# EAGLE schematic S151B (EAGLE 4.11)
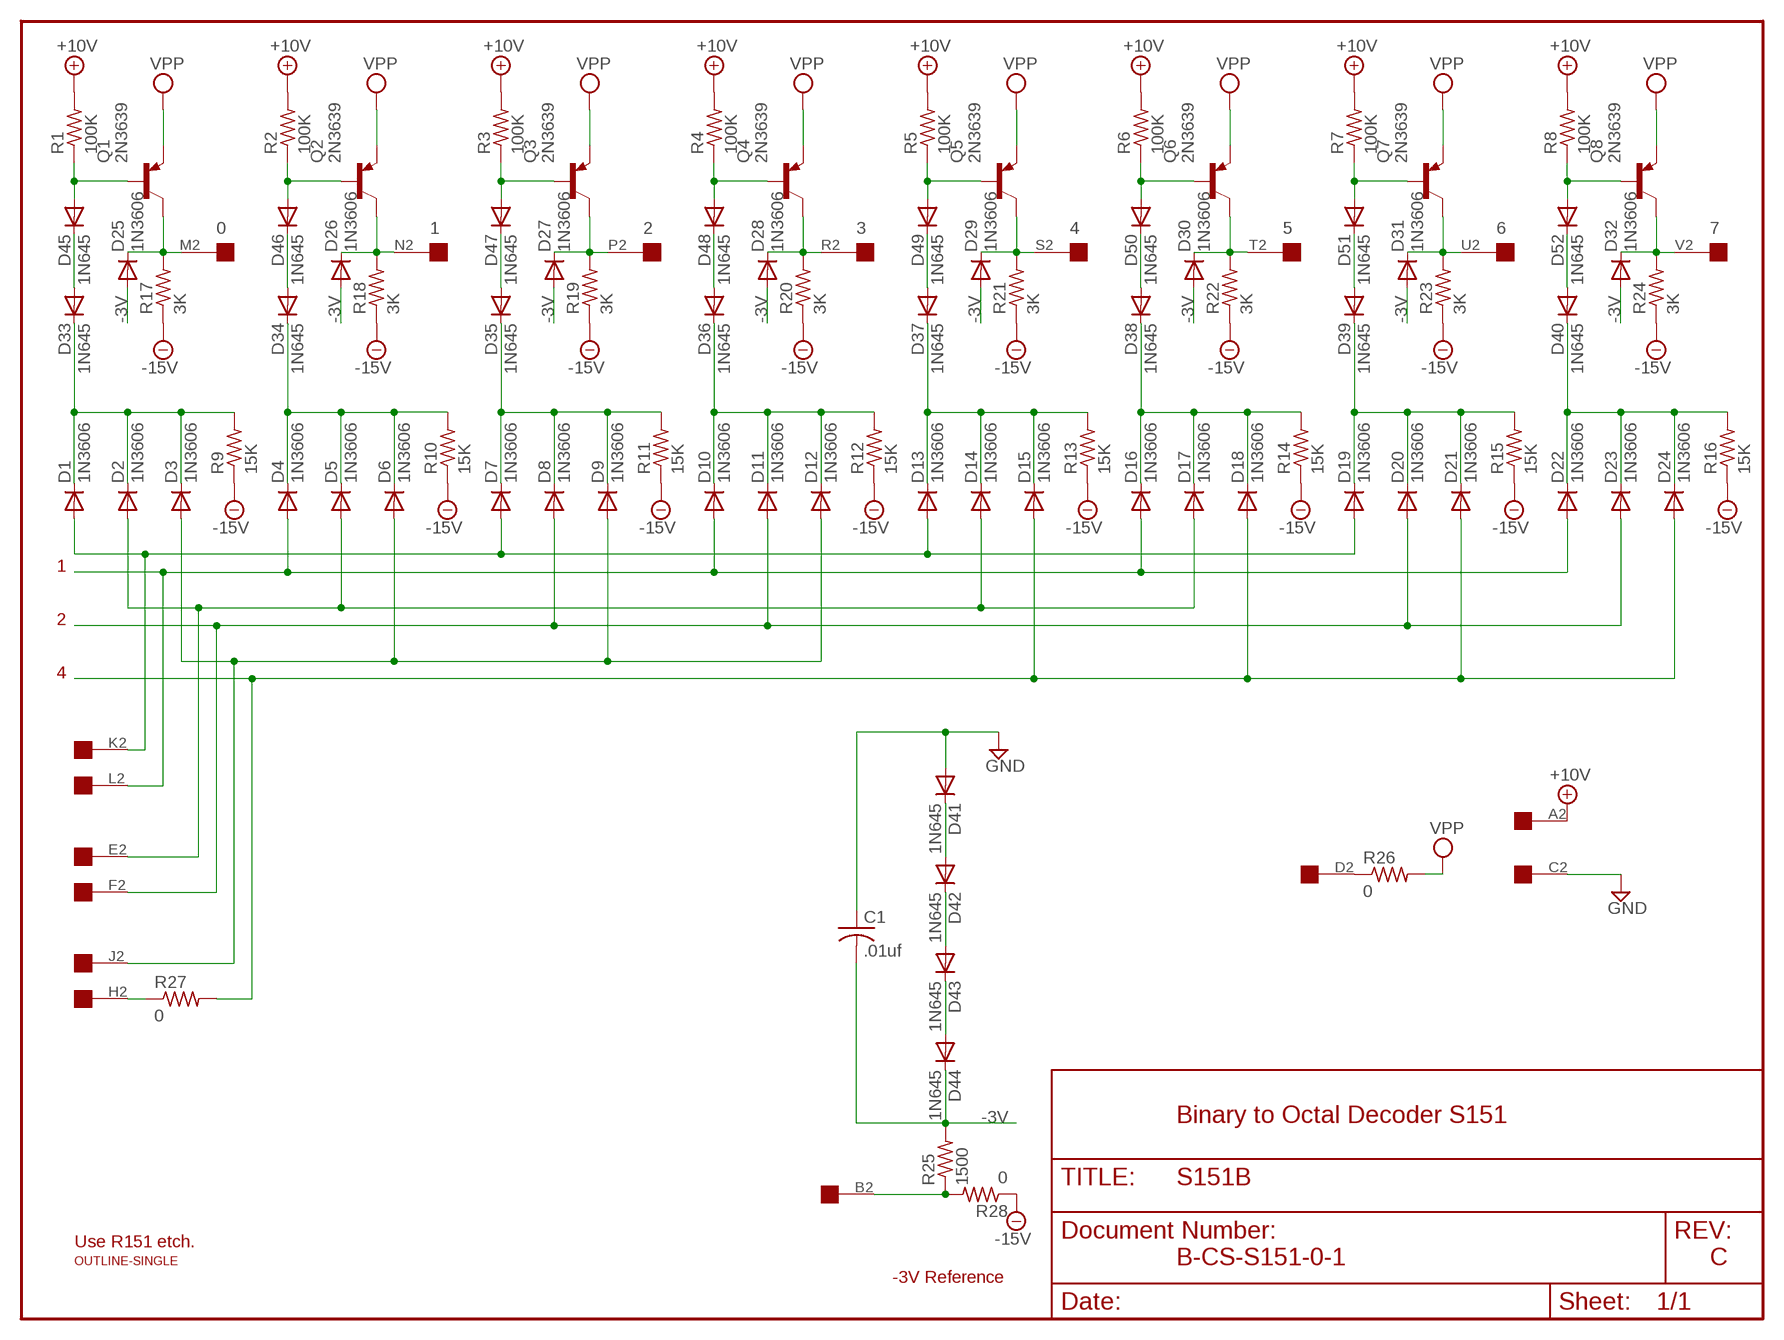
[diagram p0: schematic, sheet 1]

## Parts
C1  .01uf  C-US050-025X075  [C050-025X075]
D1  1N3606  1N4148  [DO35-10]
D2  1N3606  1N4148  [DO35-10]
D3  1N3606  1N4148  [DO35-10]
D4  1N3606  1N4148  [DO35-10]
D5  1N3606  1N4148  [DO35-10]
D6  1N3606  1N4148  [DO35-10]
D7  1N3606  1N4148  [DO35-10]
D8  1N3606  1N4148  [DO35-10]
D9  1N3606  1N4148  [DO35-10]
D10  1N3606  1N4148  [DO35-10]
D11  1N3606  1N4148  [DO35-10]
D12  1N3606  1N4148  [DO35-10]
D13  1N3606  1N4148  [DO35-10]
D14  1N3606  1N4148  [DO35-10]
D15  1N3606  1N4148  [DO35-10]
D16  1N3606  1N4148  [DO35-10]
D17  1N3606  1N4148  [DO35-10]
D18  1N3606  1N4148  [DO35-10]
D19  1N3606  1N4148  [DO35-10]
D20  1N3606  1N4148  [DO35-10]
D21  1N3606  1N4148  [DO35-10]
D22  1N3606  1N4148  [DO35-10]
D23  1N3606  1N4148  [DO35-10]
D24  1N3606  1N4148  [DO35-10]
D25  1N3606  1N4148  [DO35-10]
D26  1N3606  1N4148  [DO35-10]
D27  1N3606  1N4148  [DO35-10]
D28  1N3606  1N4148  [DO35-10]
D29  1N3606  1N4148  [DO35-10]
D30  1N3606  1N4148  [DO35-10]
D31  1N3606  1N4148  [DO35-10]
D32  1N3606  1N4148  [DO35-10]
D33  1N645  1N4148  [DO35-10]
D34  1N645  1N4148  [DO35-10]
D35  1N645  1N4148  [DO35-10]
D36  1N645  1N4148  [DO35-10]
D37  1N645  1N4148  [DO35-10]
D38  1N645  1N4148  [DO35-10]
D39  1N645  1N4148  [DO35-10]
D40  1N645  1N4148  [DO35-10]
D41  1N645  1N4148  [DO35-10]
D42  1N645  1N4148  [DO35-10]
D43  1N645  1N4148  [DO35-10]
D44  1N645  1N4148  [DO35-10]
D45  1N645  1N4148  [DO35-10]
D46  1N645  1N4148  [DO35-10]
D47  1N645  1N4148  [DO35-10]
D48  1N645  1N4148  [DO35-10]
D49  1N645  1N4148  [DO35-10]
D50  1N645  1N4148  [DO35-10]
D51  1N645  1N4148  [DO35-10]
D52  1N645  1N4148  [DO35-10]
Q1  2N3639  2N3637  [TO39]
Q2  2N3639  2N3637  [TO39]
Q3  2N3639  2N3637  [TO39]
Q4  2N3639  2N3637  [TO39]
Q5  2N3639  2N3637  [TO39]
Q6  2N3639  2N3637  [TO39]
Q7  2N3639  2N3637  [TO39]
Q8  2N3639  2N3637  [TO39]
R1  100K  R-US_0207/10  [0207/10]
R2  100K  R-US_0207/10  [0207/10]
R3  100K  R-US_0207/10  [0207/10]
R4  100K  R-US_0207/10  [0207/10]
R5  100K  R-US_0207/10  [0207/10]
R6  100K  R-US_0207/10  [0207/10]
R7  100K  R-US_0207/10  [0207/10]
R8  100K  R-US_0207/10  [0207/10]
R9  15K  R-US_0207/10  [0207/10]
R10  15K  R-US_0207/10  [0207/10]
R11  15K  R-US_0207/10  [0207/10]
R12  15K  R-US_0207/10  [0207/10]
R13  15K  R-US_0207/10  [0207/10]
R14  15K  R-US_0207/10  [0207/10]
R15  15K  R-US_0207/10  [0207/10]
R16  15K  R-US_0207/10  [0207/10]
R17  3K  R-US_0207/10  [0207/10]
R18  3K  R-US_0207/10  [0207/10]
R19  3K  R-US_0207/10  [0207/10]
R20  3K  R-US_0207/10  [0207/10]
R21  3K  R-US_0207/10  [0207/10]
R22  3K  R-US_0207/10  [0207/10]
R23  3K  R-US_0207/10  [0207/10]
R24  3K  R-US_0207/10  [0207/10]
R25  1500  R-US_0207/10  [0207/10]
R26  0  R-US_0207/10  [0207/10]
R27  0  R-US_0207/10  [0207/10]
R28  0  R-US_0207/10  [0207/10]
U$1  OUTLINE-SINGLE  [SINGLE]
U$2  EDGE-1  [EDGE-CON1]

## Nets
0: D25.C Q1.3(C) R17.2 U$2.M2
1: D26.C Q2.3(C) R18.2 U$2.N2
2: D27.C Q3.3(C) R19.2 U$2.P2
3: D28.C Q4.3(C) R20.2 U$2.R2
4: D29.C Q5.3(C) R21.2 U$2.S2
5: D30.C Q6.3(C) R22.2 U$2.T2
6: D31.C Q7.3(C) R23.2 U$2.U2
7: D32.C Q8.3(C) R24.2 U$2.V2
+10V [Power]: R1.2 R2.2 R3.2 R4.2 R5.2 R6.2 R7.2 R8.2 U$2.A2
-3V [Power]: C1.2 D25.A D26.A D27.A D28.A D29.A D30.A D31.A D32.A D44.C R25.2
-15V [Power]: R9.1 R10.1 R11.1 R12.1 R13.1 R14.1 R15.1 R16.1 R17.1 R18.1 R19.1 R20.1 R21.1 R22.1 R23.1 R24.1 R28.1
D0: D4.A D10.A D16.A D22.A U$2.L2
D0\: D1.A D7.A D13.A D19.A U$2.K2
D1: D8.A D11.A D20.A D23.A U$2.F2
D1\: D2.A D5.A D14.A D17.A U$2.E2
D2: D15.A D18.A D21.A D24.A R27.2
D2\: D3.A D6.A D9.A D12.A U$2.J2
GND [Power]: C1.1 D41.A U$2.C2
N$1 [Power]: R25.1 R28.2 U$2.B2
N$2: D46.A Q2.2(B) R2.1
N$3: D41.C D42.A
N$4: R26.1 U$2.D2
N$5: R27.1 U$2.H2
N$6: D4.C D5.C D6.C D34.C R10.2
N$7: D34.A D46.C
N$8: D47.A Q3.2(B) R3.1
N$11: D7.C D8.C D9.C D35.C R11.2
N$12: D35.A D47.C
N$13: D42.C D43.A
N$16: D43.C D44.A
N$18: D48.A Q4.2(B) R4.1
N$19: D45.A Q1.2(B) R1.1
N$22: D1.C D2.C D3.C D33.C R9.2
N$23: D33.A D45.C
N$26: D10.C D11.C D12.C D36.C R12.2
N$27: D36.A D48.C
N$33: D49.A Q5.2(B) R5.1
N$34: D13.C D14.C D15.C D37.C R13.2
N$35: D37.A D49.C
N$36: D50.A Q6.2(B) R6.1
N$37: D16.C D17.C D18.C D38.C R14.2
N$38: D38.A D50.C
N$40: D51.A Q7.2(B) R7.1
N$41: D19.C D20.C D21.C D39.C R15.2
N$42: D39.A D51.C
N$44: D52.A Q8.2(B) R8.1
N$45: D22.C D23.C D24.C D40.C R16.2
N$46: D40.A D52.C
VPP [Power]: Q1.1(E) Q2.1(E) Q3.1(E) Q4.1(E) Q5.1(E) Q6.1(E) Q7.1(E) Q8.1(E) R26.2

## Notes on the sheet
- 1
- 2
- 4
- Binary to Octal Decoder S151
- Use R151 etch.
- B-CS-S151-0-1 | C
- -3V Reference

## Library data of the parts
C1 = rcl:C-US: CAPACITOR, American symbol
D1-D52 = diode:1N4148: DIODE high speed (Philips)
Q1-Q8 = transistor-pnp:2N3637*: PNP Transistror
R1-R28 = rcl:R-US_: RESISTOR, American symbol
U$1 = dec-con:OUTLINE-*: Board outlines for DEC boards.
U$2 = dec-con:EDGE-1: Single-Sided DEC Edge Connector -- (side 2)

## Net classes
1 Power: width 0.813 mm